# Altium schematic sheet BLE112_Module.SchDoc: BLE112 Breakout Board Module
size A4; Date: 29/08/2014; CheckedBy: X; DrawnBy: P. Poryzala; Revision: 1.1; SheetNumber: 1; SheetTotal: 1; Projectnumber: OWN-000; Size: A4; Projectname: X
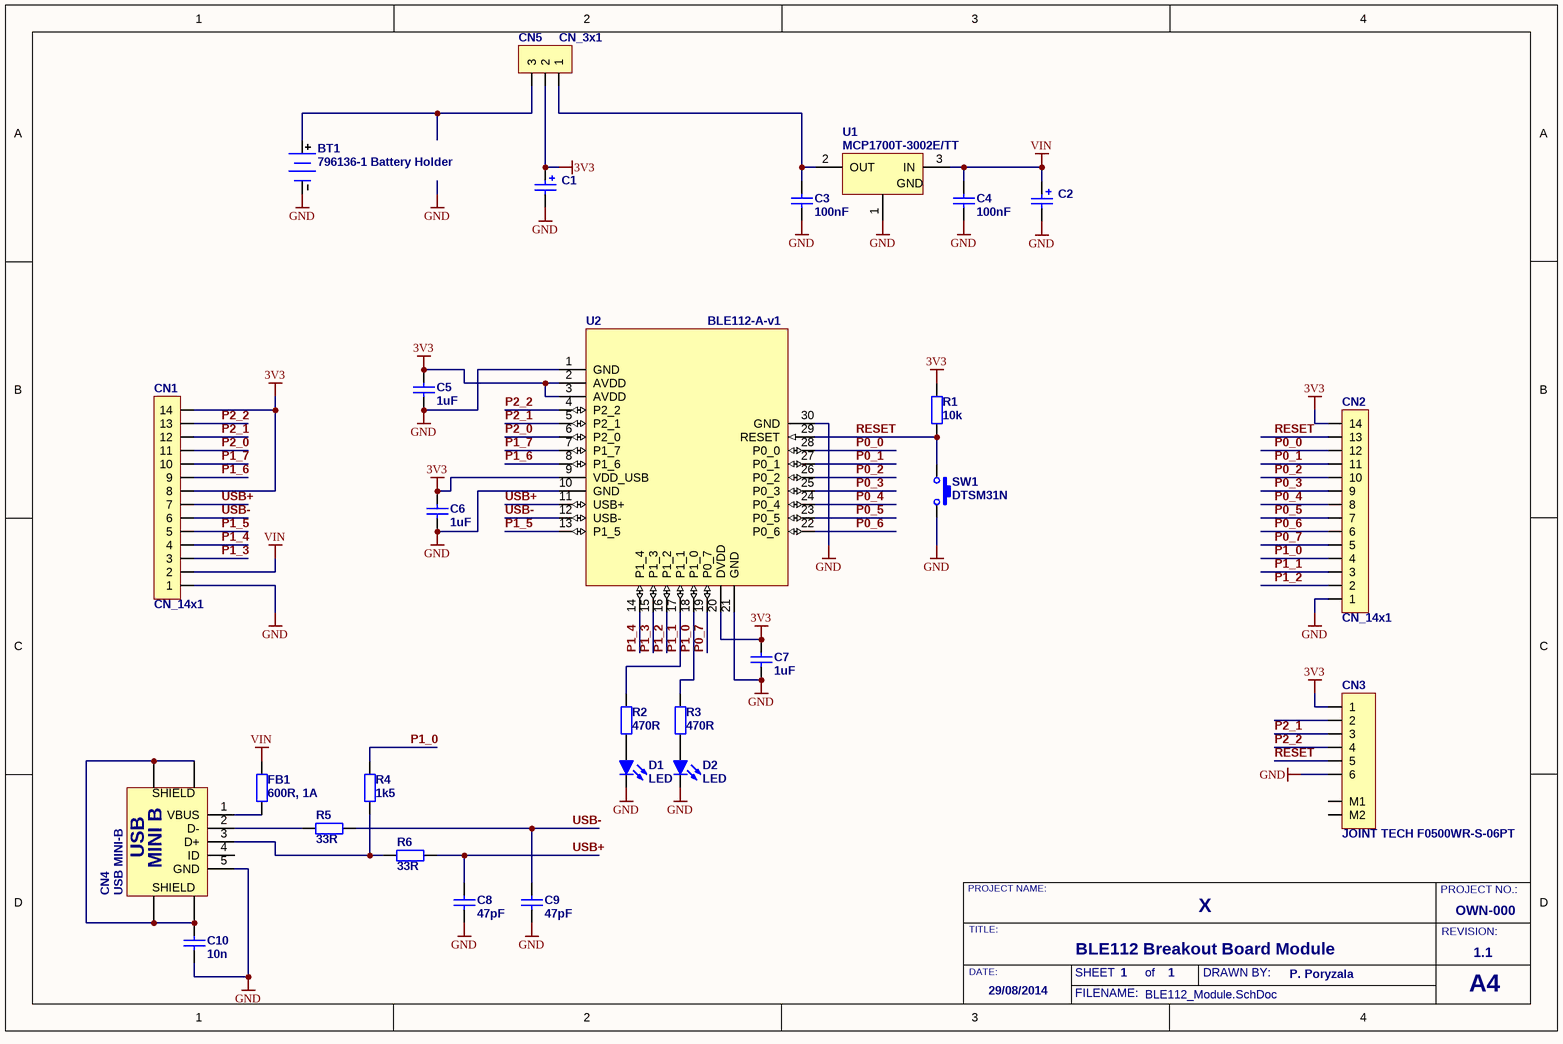
[diagram p0: BLE112_Module.SchDoc]

## Parts
BT1  796136-1 Battery Holder  [796136-1]
C1  (no value)  [SMDB]
C2  (no value)  [SMDB]
C3  100nF  [C0603]
C4  100nF  [C0603]
C5  1uF  [C0603]
C6  1uF  [C0603]
C7  1uF  [C0603]
C8  47pF  [C0603]
C9  47pF  [C0603]
C10  10n  [C0603]
CN1  CN_14x1  [GP_14x1]
CN2  CN_14x1  [GP_14x1]
CN3  JOINT TECH F0500WR-S-06PT  [F0500WR-S-06PT]
CN4  USB MINI-B  [USB-MINI-B SMD]
CN5  CN_3x1  [GP_3x1]
D1  LED  [LED0603B]
D2  LED  [LED0603R]
FB1  600R, 1A  [FB0603]
R1  10k  [R0603]
R2  470R  [R0603]
R3  470R  [R0603]
R4  1k5  [R0603]
R5  33R  [R0603]
R6  33R  [R0603]
SW1  DTSM31N  [DTSM-3]
U1  MCP1700T-3002E/TT  [SOT-23]
U2  BLE112-A-v1  [BLE112-x]

## Nets
3V3: C1.1 C5.2 C6.2 C7.2 CN1.8 CN1.14 CN2.14 CN3.1 CN5.2 R1.2 U2.2(AVDD) U2.3(AVDD) U2.9(VDD_USB) U2.20(DVDD)
GND: BT1.2(-) C1.2 C2.2 C3.1 C4.1 C5.1 C6.1 C7.1 C8.1 C9.1 C10.1 CN1.1 CN2.1 CN3.6 CN4.5(GND) D1.2(K) D2.2(K) SW1.2 U1.1(GND) U2.1(GND) U2.10(GND) U2.21(GND) U2.30(GND)
VIN: C2.1 C4.2 CN1.2 FB1.2 U1.3(IN)
P0_0: CN2.12 U2.28(P0_0)
P0_1: CN2.11 U2.27(P0_1)
P0_2: CN2.10 U2.26(P0_2)
P0_3: CN2.9 U2.25(P0_3)
P0_4: CN2.8 U2.24(P0_4)
P0_5: CN2.7 U2.23(P0_5)
P0_6: CN2.6 U2.22(P0_6)
P0_7: CN2.5 U2.19(P0_7)
P1_0: CN2.4 R3.2 R4.1 U2.18(P1_0)
P1_1: CN2.3 R2.2 U2.17(P1_1)
P1_2: CN2.2 U2.16(P1_2)
P1_3: CN1.3 U2.15(P1_3)
P1_4: CN1.4 U2.14(P1_4)
P1_5: CN1.5 U2.13(P1_5)
P1_6: CN1.9 U2.8(P1_6)
P1_7: CN1.10 U2.7(P1_7)
P2_0: CN1.11 U2.6(P2_0)
P2_1: CN1.12 CN3.3 U2.5(P2_1)
P2_2: CN1.13 CN3.4 U2.4(P2_2)
RESET: CN2.13 CN3.5 R1.1 SW1.1 U2.29(RESET)
USB+: C8.2 CN1.7 R6.1 U2.11(USB+)
USB-: C9.2 CN1.6 R5.1 U2.12(USB-)
NetBT1_1: BT1.1(+) CN5.3
NetC3_2: C3.2 CN5.1 U1.2(OUT)
NetC10_2: C10.2 CN4.6(SHIELD) CN4.7(SHIELD) CN4.8(SHIELD) CN4.9(SHIELD)
NetCN4_1: CN4.1(VBUS) FB1.1
NetCN4_2: CN4.2(D-) R5.2
NetCN4_3: CN4.3(D+) R4.2 R6.2
NetD1_1: D1.1(A) R2.1
NetD2_1: D2.1(A) R3.1

Not connected (* = marked no-connect by the designer): CN3 2 9(M1) 10(M2); CN4 4(ID)

## Notes on the sheet
- PROJECT NAME:
- PROJECT NO.:
- DATE:
- TITLE:
- SHEET
- of
- DRAWN BY:
- REVISION:
- FILENAME:
- A4
- (in symbol USB MINI-B) USB; MINI B

## Library data of the parts
BT1 = 796136-1: Tyco Connectivity 796136-1 CR2032 Battery Holder; Published: 24-Mar-1999; Revision: July-2002: Re-released for DXP Platform.; Publisher: Altium Limited
C1 C2 = Cap Pol Tant: Polarized Tantalum Capacitor; ComponentLink1Description: datasheet; ComponentLink2Description: supplier
C3-C10 = Cap: Capacitor; ComponentLink1Description: datasheet; ComponentLink2Description: supplier
  C3 C4: Value: 100nF
  C5-C7: Value: 1uF
  C8 C9: Value: 47pF
  C10: Value: 10n
CN3 = JOINT TECH F0500WR-S-06PT: 0.50mm Pitch FFC/FPC Connector, SMT, Right Angle, ZIF, Top Contact Style Receptacle, 6 Circuits
CN4 = USB MINI-B: USB Mini-B Receptacle; Published: 20-Mar-2006
D1 D2 = LED: Typical RED, GREEN, YELLOW, AMBER GaAs LED; Published: 04-Apr-2006
FB1 = LCBA-601: Ferrite Bead; Imp.@ 100MHz:600R; Mounting: SMD; 1A; Case: 0603; Published: 19-Feb-2006; ComponentLink1Description: datasheet; ComponentLink2Description: supplier; Supplier 1: TME; Supplier 2: TME; Supplier Part Number 1: LCBA-601; Supplier Part Number 2: PBY160808T-601Y; Value: 600R, 1A
R1-R6 = Res: Resistor; Published: 19-Feb-2006; ComponentLink1Description: datasheet; ComponentLink2Description: supplier
  R1: Value: 10k
  R2 R3: Value: 470R
  R4: Value: 1k5
  R5 R6: Value: 33R
SW1 = DTSM31N: DIPTRONICS 6x3,5mm SMD Tactile SPST-NO Switch
U1 = MCP1700T-3002E/TT: 250mA, Low Voltage, Low Quiescent Current (1.6uA) LDO Voltage Regulator; Published: 24-Aug-2001; LatestRevisionDate: 06-Jun-2005; LatestRevisionNote: PCB Pin sequence re-ordered.; DatasheetVersion: Feb-2004; PackageVersion: Jul-2004; PackageReference: TO-220A; Publisher: Altium Limited; PackageDescription: TO, Thru-Hole, Vertical, Heatsink Mounted; 3 In-Line Leads; Pitch 2.54 mm; ComponentLink1Description: Manufacturer Link; ComponentLink1URL: http://www.st.com/; ComponentLink2Description: Datasheet; ComponentLink2URL: http://www.st.com/stonline/books/pdf/docs/2574.pdf
U2 = BLE112-A-v1: Bluetooth ®  low energy single mode module